# Altium schematic sheet PSOC.SchDoc
size A
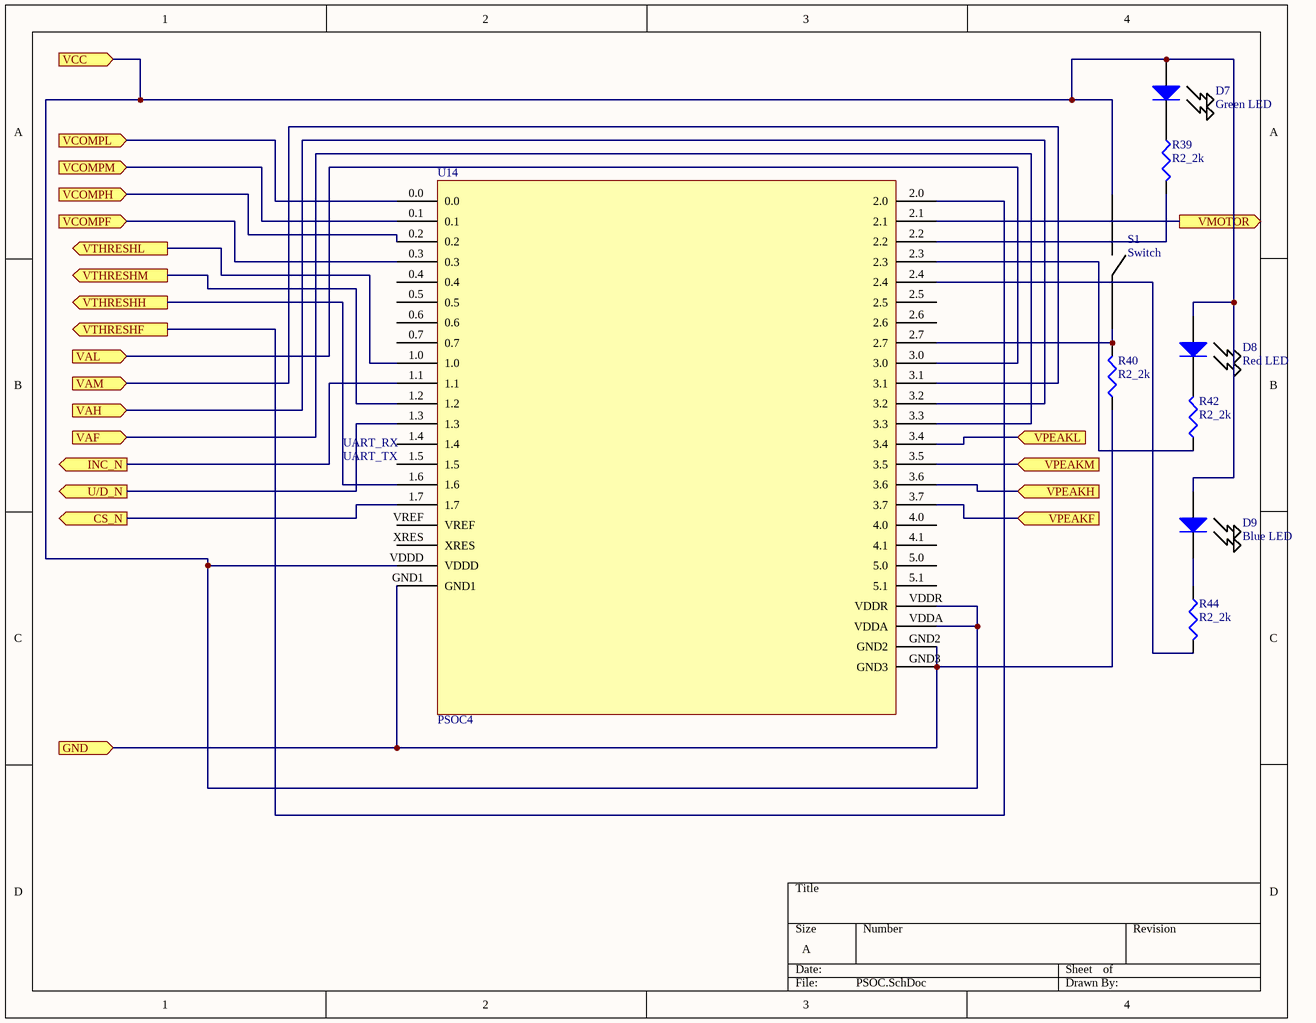
[diagram p0: PSOC.SchDoc]

## Parts
D7  Green LED  [MLEGRN-A1]
D8  Red LED  [MLERED-A1]
D9  Blue LED  [MLEBLU-A1]
R39  R2_2k  [R0603]
R40  R2_2k  [R0603]
R42  R2_2k  [R0603]
R44  R2_2k  [R0603]
S1  Switch  [CHS-01TB]
U14  PSOC4  [PSOC4XXX-BLE]

## Ports
CS_N (out), GND (in), INC_N (out), U/D_N (out), VAF (in), VAH (in), VAL (in), VAM (in), VCC (in), VCOMPF (in), VCOMPH (in), VCOMPL (in), VCOMPM (in), VMOTOR (out), VPEAKF (in), VPEAKH (in), VPEAKL (in), VPEAKM (in), VTHRESHF (out), VTHRESHH (out), VTHRESHL (out), VTHRESHM (out)

## Nets
CS_N: U14.1.7 ; port CS_N
GND: R40.1 U14.GND1 U14.GND2 U14.GND3 ; port GND
INC_N: U14.1.1 ; port INC_N
U/D_N: U14.1.3 ; port U/D_N
VAF: U14.3.3 ; port VAF
VAH: U14.3.2 ; port VAH
VAL: U14.3.0 ; port VAL
VAM: U14.3.1 ; port VAM
VCC: D7.A D8.A D9.A S1.1 U14.VDDA U14.VDDD U14.VDDR ; port VCC
VCOMPF: U14.0.3 ; port VCOMPF
VCOMPH: U14.0.2 ; port VCOMPH
VCOMPL: U14.0.0 ; port VCOMPL
VCOMPM: U14.0.1 ; port VCOMPM
VMOTOR: U14.2.1 ; port VMOTOR
VPEAKF: U14.3.7 ; port VPEAKF
VPEAKH: U14.3.6 ; port VPEAKH
VPEAKL: U14.3.4 ; port VPEAKL
VPEAKM: U14.3.5 ; port VPEAKM
VTHRESHF: U14.2.0 ; port VTHRESHF
VTHRESHH: U14.1.6 ; port VTHRESHH
VTHRESHL: U14.1.0 ; port VTHRESHL
VTHRESHM: U14.1.2 ; port VTHRESHM
NetD7_C: D7.C R39.1
NetD8_C: D8.C R42.2
NetD9_C: D9.C R44.1
NetR39_2: R39.2 U14.2.2
NetR40_2: R40.2 S1.2 U14.2.7
NetR42_1: R42.1 U14.2.3
NetR44_2: R44.2 U14.2.4

Not connected (* = marked no-connect by the designer): U14 0.4 0.5 0.6 0.7 1.4 1.5 2.5 2.6 4.0 4.1 5.0 5.1 VREF XRES

## Notes on the sheet
- (near U14) UART_TX
- (near U14) UART_RX

## Library data of the parts
D7 = LED_G: Manufacturer: Cree Inc.; Manufacturer Part Number: MLEGRN-A1-0000-000001; Wavelength: 528nm (520nm ~ 535nm); Current - Test: 150mA; Voltage - Forward (Vf) (Typ): 3.3V; Lumens/Watt @ Current - Test: 67 lm/W; Current - Max: 350mA; Flux @ Current/Temperature - Test: 33 lm (31 lm ~ 35 lm); Temperature - Test: 25°C; Viewing Angle: 125°; Thermal Resistance of Package: 15°C/W; Supplier 1: Digi-Key; RoHS: RoHS Compliant; Category: Optoelectronics; Stock 1: 2607; Pricing 1: 1=1.34, 100=1.1891, 250=1.08572, 500=0.9823 (USD); Packaging: Cut Tape (CT); Part Status: Active; Color: Green; Mounting Type: Surface Mount; Package / Case: 4-SMD, J-Lead Exposed Pad; ComponentLink1URL: http://www.cree.com/~/media/Files/Cree/LED%20Components%20and%20Modules/XLamp/Data%20and%20Binning/XlampMLE.pdf; ComponentLink1Description: http://www.cree.com/~/media/Files/Cree/LED%20Components%20and%20Modules/XLamp/Data%20and%20Binning/XlampMLE.pdf; Supplier Part Number 1: MLEGRN-A1-0000-000001CT-ND
D8 = LED_R: Manufacturer: Cree Inc.; Manufacturer Part Number: MLERED-A1-0000-000V01; Wavelength: 625nm (620nm ~ 630nm); Current - Test: 150mA; Voltage - Forward (Vf) (Typ): 2.4V; Lumens/Watt @ Current - Test: 58 lm/W; Current - Max: 350mA; Flux @ Current/Temperature - Test: 21 lm (18 lm ~ 24 lm); Temperature - Test: 25°C; Viewing Angle: 120°; Thermal Resistance of Package: 15°C/W; Supplier 1: Digi-Key; RoHS: RoHS Compliant; Category: Optoelectronics; Stock 1: 7000; Pricing 1: 1=1.2, 100=1.0626, 250=0.9702, 500=0.8778 (USD); Packaging: Cut Tape (CT); Part Status: Active; Color: Red; Mounting Type: Surface Mount; Package / Case: 4-SMD, J-Lead Exposed Pad; ComponentLink1URL: http://www.cree.com/~/media/Files/Cree/LED%20Components%20and%20Modules/XLamp/Data%20and%20Binning/XlampMLE.pdf; ComponentLink1Description: http://www.cree.com/~/media/Files/Cree/LED%20Components%20and%20Modules/XLamp/Data%20and%20Binning/XlampMLE.pdf; Supplier Part Number 1: MLERED-A1-0000-000V01CT-ND
D9 = LED_B: Manufacturer: Cree Inc.; Manufacturer Part Number: MLEBLU-A1-0000-000T01; Wavelength: 475nm (465nm ~ 485nm); Current - Test: 150mA; Voltage - Forward (Vf) (Typ): 3.2V; Lumens/Watt @ Current - Test: 27 lm/W; Current - Max: 350mA; Flux @ Current/Temperature - Test: 13 lm (11 lm ~ 14 lm); Temperature - Test: 25°C; Viewing Angle: 125°; Thermal Resistance of Package: 11°C/W; Supplier 1: Digi-Key; RoHS: RoHS Compliant; Category: Optoelectronics; Stock 1: 13229; Pricing 1: 1=0.8, 10=0.76, 50=0.7384, 100=0.68, 200=0.6184, 500=0.5792 (USD); Packaging: Cut Tape (CT); Part Status: Active; Color: Blue; Mounting Type: Surface Mount; Package / Case: 4-SMD, J-Lead Exposed Pad; Supplier Device Package: SMD; Size / Dimension: 0.138" L x 0.124" W (3.50mm x 3.15mm); Height - Seated (Max): 0.052" (1.33mm); ComponentLink1URL: http://www.cree.com/~/media/Files/Cree/LED%20Components%20and%20Modules/XLamp/Data%20and%20Binning/XlampMLE.pdf; ComponentLink1Description: http://www.cree.com/~/media/Files/Cree/LED%20Components%20and%20Modules/XLamp/Data%20and%20Binning/XlampMLE.pdf; Supplier Part Number 1: MLEBLU-A1-0000-000T01CT-ND
R39 R40 R42 R44 = R2_2k: 2.2k Ohms Surface Mount Resistor; Manufacturer: Yageo; Manufacturer Part Number: RC0603FR-072K2L; Tolerance: ±1%; Power (Watts): 0.1W, 1/10W; Temperature Coefficient: ±100ppm/°C; Supplier 1: Digi-Key; RoHS: RoHS Compliant; Category: Resistors; Stock 1: 4524664; Pricing 1: 1=0.1, 10=0.013, 25=0.0092, 50=0.007, 100=0.0052, 250=0.00396, 500=0.00316, 1000=0.00233 (USD); Packaging: Digi-Reel®; Part Status: Active; Resistance (Ohms): 2.2k; Composition: Thick Film; Features: Moisture Resistant; Operating Temperature: -55°C ~ 155°C; Package / Case: 0603 (1608 Metric); Supplier Device Package: 0603; Size / Dimension: 0.063" L x 0.031" W (1.60mm x 0.80mm); Height - Seated (Max): 0.022" (0.55mm); Number of Terminations: 2; Failure Rate: -; ComponentLink1URL: http://www.yageo.com/NewPortal/yageodocoutput?fileName=/pdf/R-Chip/PYu-RC_Group_51_RoHS_L_4.pdf; ComponentLink1Description: http://www.yageo.com/NewPortal/yageodocoutput?fileName=/pdf/R-Chip/PYu-RC_Group_51_RoHS_L_4.pdf; Supplier Part Number 1: 311-2.20KHRDKR-ND
S1 = Switch: Surface Mount Switch; Manufacturer: Copal Electronics Inc.; Circuit: SPST; Number of Positions: 1; Current Rating: 100mA; Voltage Rating: 6VDC; Actuator Type: Slide (Standard); Actuator Level: Flush, Recessed; Pitch: 0.050" (1.27mm), Half; Washable: Yes; Body Material: Polyphenylene Sulfide (PPS); Electrical Life: 2,000 Cycles; Supplier 1: Digi-Key; Manufacturer Part Number: CHS-01TB; RoHS: RoHS Compliant; Category: Switches; Stock 1: 50184; Pricing 1: 1=0.97, 10=0.952, 25=0.8976, 50=0.8424, 100=0.8059, 250=0.76924, 500=0.69598 (USD); Packaging: Digi-Reel®; Part Status: Active; Contact Material: Copper Alloy; Contact Finish: Gold; Height Above Board: 0.098" (2.50mm); Mounting Type: Surface Mount; Termination Style: Gull Wing; Features: Tape Seal; Length: 0.098" (2.50mm); Operating Temperature: -40°C ~ 85°C; Mechanical Life: -; ComponentLink1URL: http://www.nidec-copal-electronics.com/e/catalog/switch/chs.pdf; ComponentLink1Description: http://www.nidec-copal-electronics.com/e/catalog/switch/chs.pdf; Supplier Part Number 1: 563-1004-6-ND
U14 = PSOC4: PSOC4 Connector; Manufacturer: JST Sales America Inc.; Manufacturer Part Number: B14B-PH-K-S(LF)(SN); Connector Type: Header, Shrouded; Pitch: 0.079" (2.00mm); Number of Positions: 14; Number of Positions Loaded: All; Supplier 1: Digi-Key; RoHS: RoHS Compliant; Category: Connectors, Interconnects; Stock 1: 1457; Pricing 1: 1=0.63, 10=0.592, 100=0.4536, 500=0.39444, 1000=0.32542, 5000=0.28597, 10000=0.26625 (USD); Packaging: Bulk; Part Status: Active; Contact Type: Male Pin; Number of Rows: 1; Row Spacing: -; Mounting Type: Through Hole; Termination: Press-Fit, Solder; Fastening Type: Detent Lock; Contact Mating Length: 0.130" (3.30mm); Features: -; Contact Finish: Tin; Contact Finish Thickness: -; Color: Natural; ComponentLink1URL: http://www.jst-mfg.com/product/pdf/eng/ePH.pdf; ComponentLink1Description: http://www.jst-mfg.com/product/pdf/eng/ePH.pdf; Supplier Part Number 1: 455-1716-ND